# Altium schematic sheet pyESP32.SchDoc
size A4
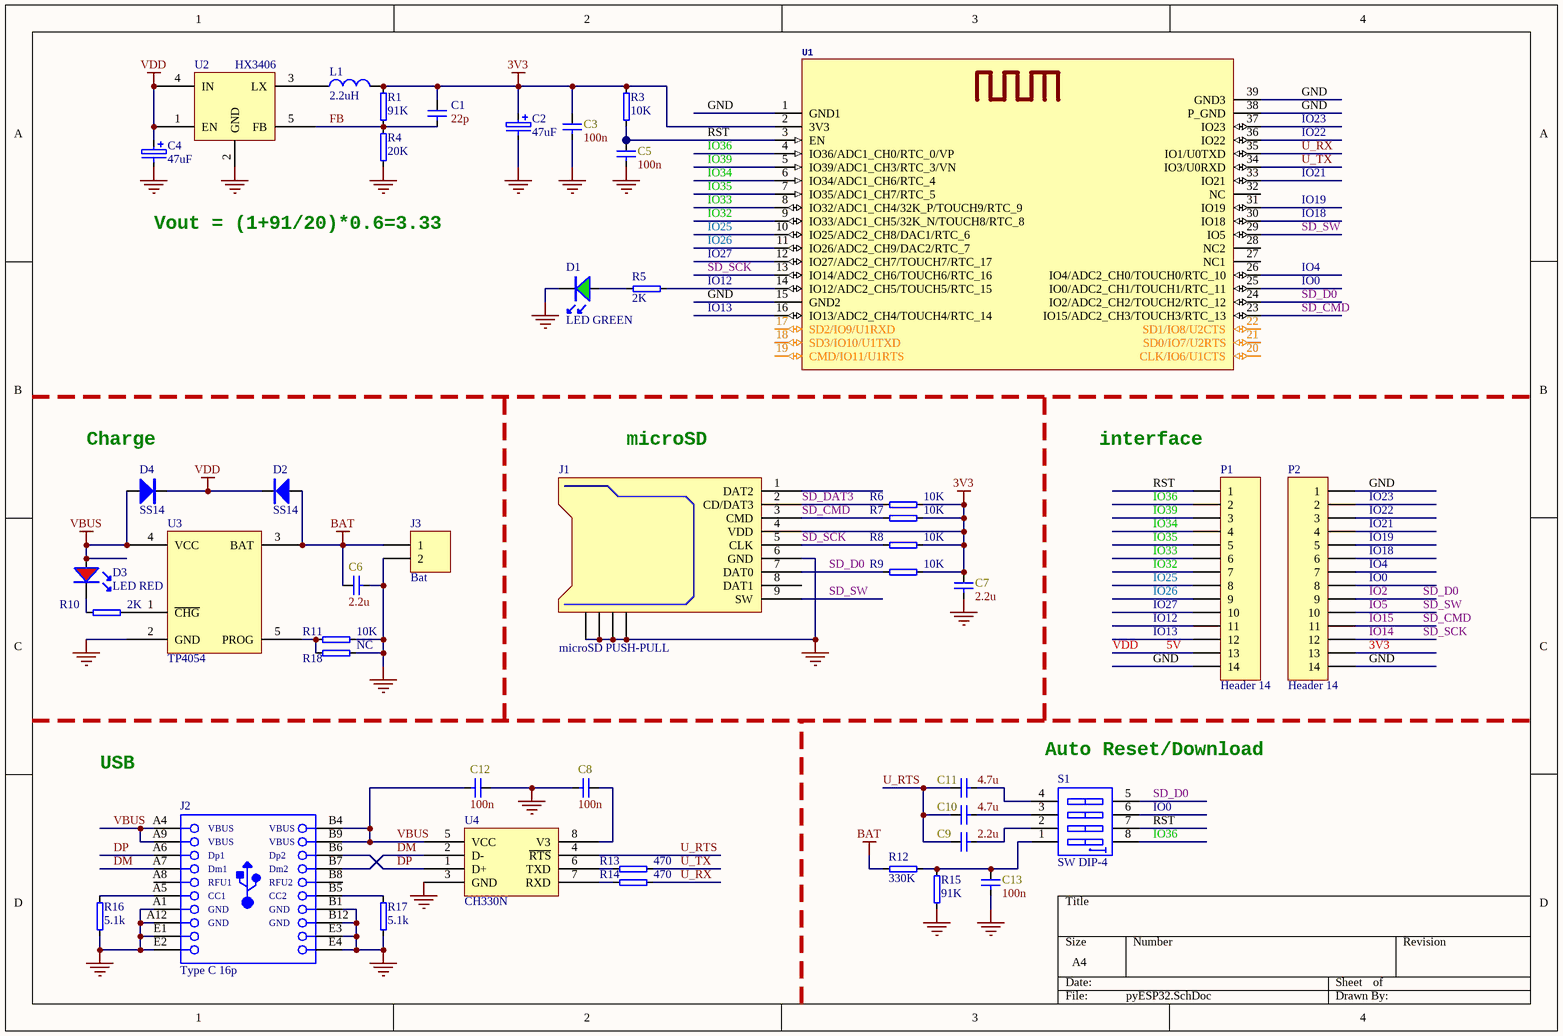
[diagram p0: pyESP32.SchDoc]

## Parts
C1  22p  [C0402]
C2  47uF  [3216]
C3  100n  [C0402]
C4  47uF  [3216]
C5  100n  [C0402]
C6  2.2u  [C0402]
C7  2.2u  [C0402]
C8  100n  [C0402]
C9  2.2u  [C0402]
C10  4.7u  [C0402]
C11  4.7u  [C0402]
C12  100n  [C0402]
C13  100n  [C0402]
D1  LED GREEN  [LED_0603_GREEN]
D2  SS14  [SOD-123]
D3  LED RED  [LED_0603_RED]
D4  SS14  [SOD-123]
J1  microSD PUSH-PULL  [microSD-1]
J2  Type C 16p  [Type-C 16P]
J3  Bat  [2P-1.25]
L1  2.2uH  [IND-252012]
P1  Header 14  [HDR1X14]
P2  Header 14  [HDR1X14]
R1  91K  [SMD0402]
R3  10K  [SMD0402]
R4  20K  [SMD0402]
R5  2K  [SMD0402]
R6  10K  [SMD0402]
R7  10K  [SMD0402]
R8  10K  [SMD0402]
R9  10K  [SMD0402]
R10  2K  [SMD0402]
R11  10K  [SMD0402]
R12  330K  [SMD0402]
R13  470  [SMD0402]
R14  470  [SMD0402]
R15  91K  [SMD0402]
R16  5.1k  [SMD0402]
R17  5.1k  [SMD0402]
R18  NC  [SMD0402]
S1  SW DIP-4  [SW-SMD4]
U1  ESP32-WROVER  [ESP32-WROVER]  (value not drawn)
U2  HX3406  [SOT23-5]
U3  TP4054  [SOT23-5]
U4  CH330N  [NSO8_M]

## Nets
3V3: C1.2 C2.1 C3.2 C7.2 J1.4(VDD) L1.2 P2.13 R1.2 R3.2 R6.1 R7.1 R8.1 R9.1 U1.2(3V3)
5V: C4.1 D2.2 D4.2 P1.13 U2.1(EN) U2.4(IN)  [also labelled VDD]
BAT: C6.2 D2.1 J3.1 R12.2 U3.3(BAT)
GND: C2.2 C3.1 C4.2 C5.1 C6.1 C7.1 C8.1 C12.2 C13.1 D1.2 J1.6(GND) J1.GP1 J1.GP2 J1.GP3 J1.GP4 J2.A1(GND) J2.A12(GND) J2.B1(GND) J2.B12(GND) J2.E1 J2.E2 J2.E3 J2.E4 J3.2 P1.14 P2.1 P2.14 R4.1 R11.1 R15.1 R16.2 R17.2 R18.1 U1.1(GND1) U1.15(GND2) U1.38(P_GND) U1.39(GND3) U2.2(GND) U3.2(GND) U4.3(GND)
VBUS: C12.1 D3.1 D4.1 J2.A4(VBUS) J2.A9(VBUS) J2.B4(VBUS) J2.B9(VBUS) U3.4(VCC) U4.5(VCC)
DM: J2.A7(Dm1) J2.B7(Dm2) U4.2(D-)
DP: J2.A6(Dp1) J2.B6(Dp2) U4.1(D+)
FB: C1.1 R1.1 R4.2 U2.5(FB)
IO0: P2.8 S1.6(B3) U1.25(IO0/ADC2_CH1/TOUCH1/RTC_11)
IO2: J1.7(DAT0) P2.9 R9.2 S1.5(B4) U1.24(IO2/ADC2_CH2/TOUCH2/RTC_12)  [also labelled SD_D0]
IO4: P2.7 U1.26(IO4/ADC2_CH0/TOUCH0/RTC_10)
IO5: J1.9(SW) P2.10 U1.29(IO5)  [also labelled SD_SW]
IO12: P1.11 R5.2 U1.14(IO12/ADC2_CH5/TOUCH5/RTC_15)
IO13: P1.12 U1.16(IO13/ADC2_CH4/TOUCH4/RTC_14)
IO14: J1.5(CLK) P2.12 R8.2 U1.13(IO14/ADC2_CH6/TOUCH6/RTC_16)  [also labelled SD_SCK]
IO15: J1.3(CMD) P2.11 R7.2 U1.23(IO15/ADC2_CH3/TOUCH3/RTC_13)  [also labelled SD_CMD]
IO18: P2.6 U1.30(IO18)
IO19: P2.5 U1.31(IO19)
IO21: P2.4 U1.33(IO21)
IO22: P2.3 U1.36(IO22)
IO23: P2.2 U1.37(IO23)
IO25: P1.8 U1.10(IO25/ADC2_CH8/DAC1/RTC_6)
IO26: P1.9 U1.11(IO26/ADC2_CH9/DAC2/RTC_7)
IO27: P1.10 U1.12(IO27/ADC2_CH7/TOUCH7/RTC_17)
IO32: P1.7 U1.9(IO33/ADC1_CH5/32K_N/TOUCH8/RTC_8)
IO33: P1.6 U1.8(IO32/ADC1_CH4/32K_P/TOUCH9/RTC_9)
IO34: P1.4 U1.6(IO34/ADC1_CH6/RTC_4)
IO35: P1.5 U1.7(IO35/ADC1_CH7/RTC_5)
IO36: P1.2 S1.8(B1) U1.4(IO36/ADC1_CH0/RTC_0/VP)
IO39: P1.3 U1.5(IO39/ADC1_CH3/RTC_3/VN)
RST: C5.2 P1.1 R3.1 S1.7(B2) U1.3(EN)
SD_DAT3: J1.2(CD/DAT3) R6.2
U_RTS: C9.2 C10.2 C11.2 U4.4(~{RTS})
U_RX: R14.2 U1.35(IO1/U0TXD)
U_TX: R13.2 U1.34(IO3/U0RXD)
NetC8_2: C8.2 U4.8(V3)
NetC9_1: C9.1 S1.2(A2)
NetC10_1: C10.1 S1.3(A3)
NetC11_1: C11.1 S1.4(A4)
NetC13_2: C13.2 R12.1 R15.2 S1.1(A1)
NetD1_1: D1.1 R5.1
NetD3_2: D3.2 R10.2
NetJ2_A5: J2.A5(CC1) R16.1
NetJ2_B5: J2.B5(CC2) R17.1
NetL1_1: L1.1 U2.3(LX)
NetR10_1: R10.1 U3.1(~{CHG})
NetR11_2: R11.2 R18.2 U3.5(PROG)
NetR13_1: R13.1 U4.6(TXD)
NetR14_1: R14.1 U4.7(RXD)

Not connected (* = marked no-connect by the designer): J1 1(DAT2) 8(DAT1); J2 A8(RFU1) B8(RFU2); U1 17(SD2/IO9/U1RXD) 18(SD3/IO10/U1TXD) 19(CMD/IO11/U1RTS) 20(CLK/IO6/U1CTS) 21(SD0/IO7/U2RTS) 22(SD1/IO8/U2CTS) 27(NC1) 28(NC2) 32(NC)

## Notes on the sheet
- Vout = (1+91/20)*0.6=3.33
- (near D4) Charge
- (near J1) microSD
- interface
- USB
- (near S1) Auto Reset/Download

## Library data of the parts
C1 C3 C5-C13 = Cap
C2 C4 = E
D1 = LED-GREEN: Green LED
D2 D4 = Diode
D3 = LED-RED: RED LED
J3 = Header 2: Header, 2-Pin; LatestRevisionDate: 17-Jul-2002; LatestRevisionNote: Re-released for DXP Platform.; Publisher: Altium Limited
L1 = Inductor: Code_IEC: 1005; Published: 8-Jun-2000; LatestRevisionDate: 17-Jul-2002; LatestRevisionNote: Re-released for DXP Platform.; PackageReference: 0402-A; Publisher: Altium Limited; Code_JEITA: 0402
P1 P2 = Header 14: Header, 14-Pin; LatestRevisionDate: 17-Jul-2002; LatestRevisionNote: Re-released for DXP Platform.; Publisher: Altium Limited
R1 R3-R18 = Res
S1 = SW DIP-4: DIP Switch, 4 Position, SPST; Published: 24-Mar-1999; LatestRevisionDate: 29-May-2009; LatestRevisionNote: IPC-7351 Footprint Added.; PackageReference: SO8; Publisher: Altium Limited; Code_JEDEC: MS-012-AA; PackageVersion: Dec-2002; PackageDescription: 8-Pin Small Outline Integrated Circuit 1.27 mm Pitch; Code_IPC: SOIC127P600-8
U2 = SY8089
U1 = ESP32-WROVER: LibraryName: ESP32-Wrover; DeviceSetName: ESP32-WROVER